# EAGLE design ServoMatrix_1_2 (EAGLE 4.16)
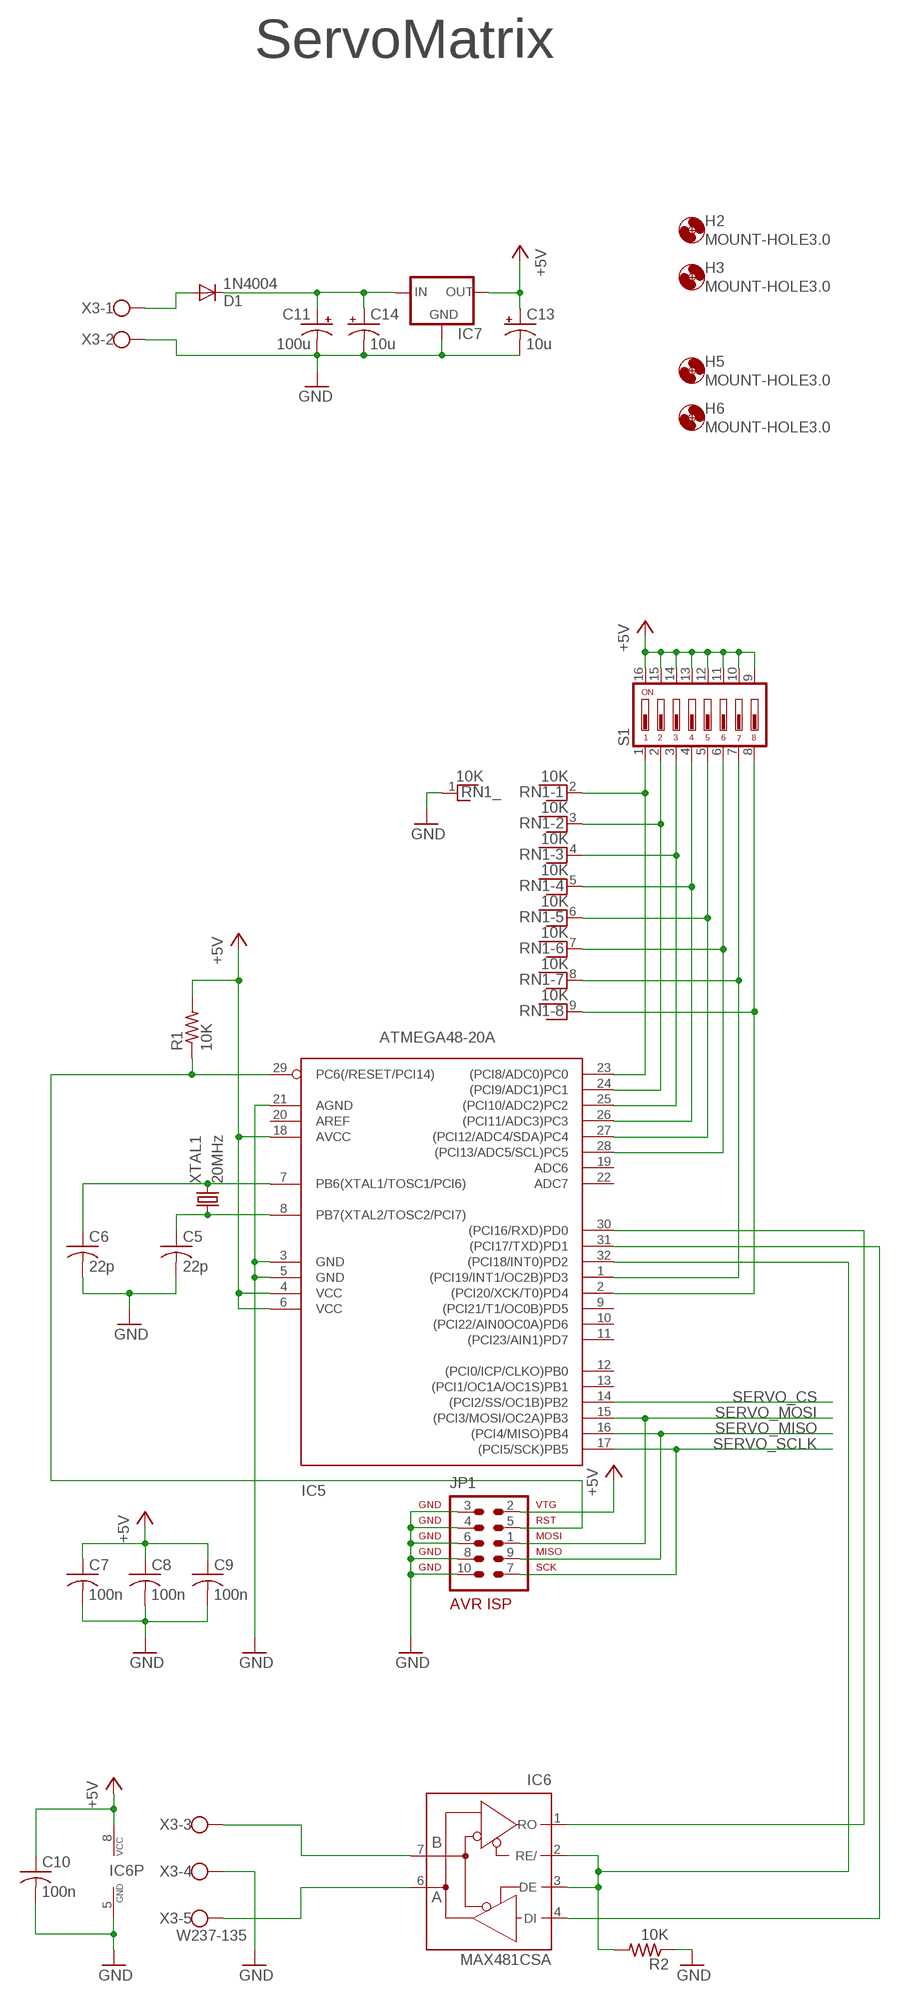
[diagram p0: schematic, sheet 1, part 1 of 2]
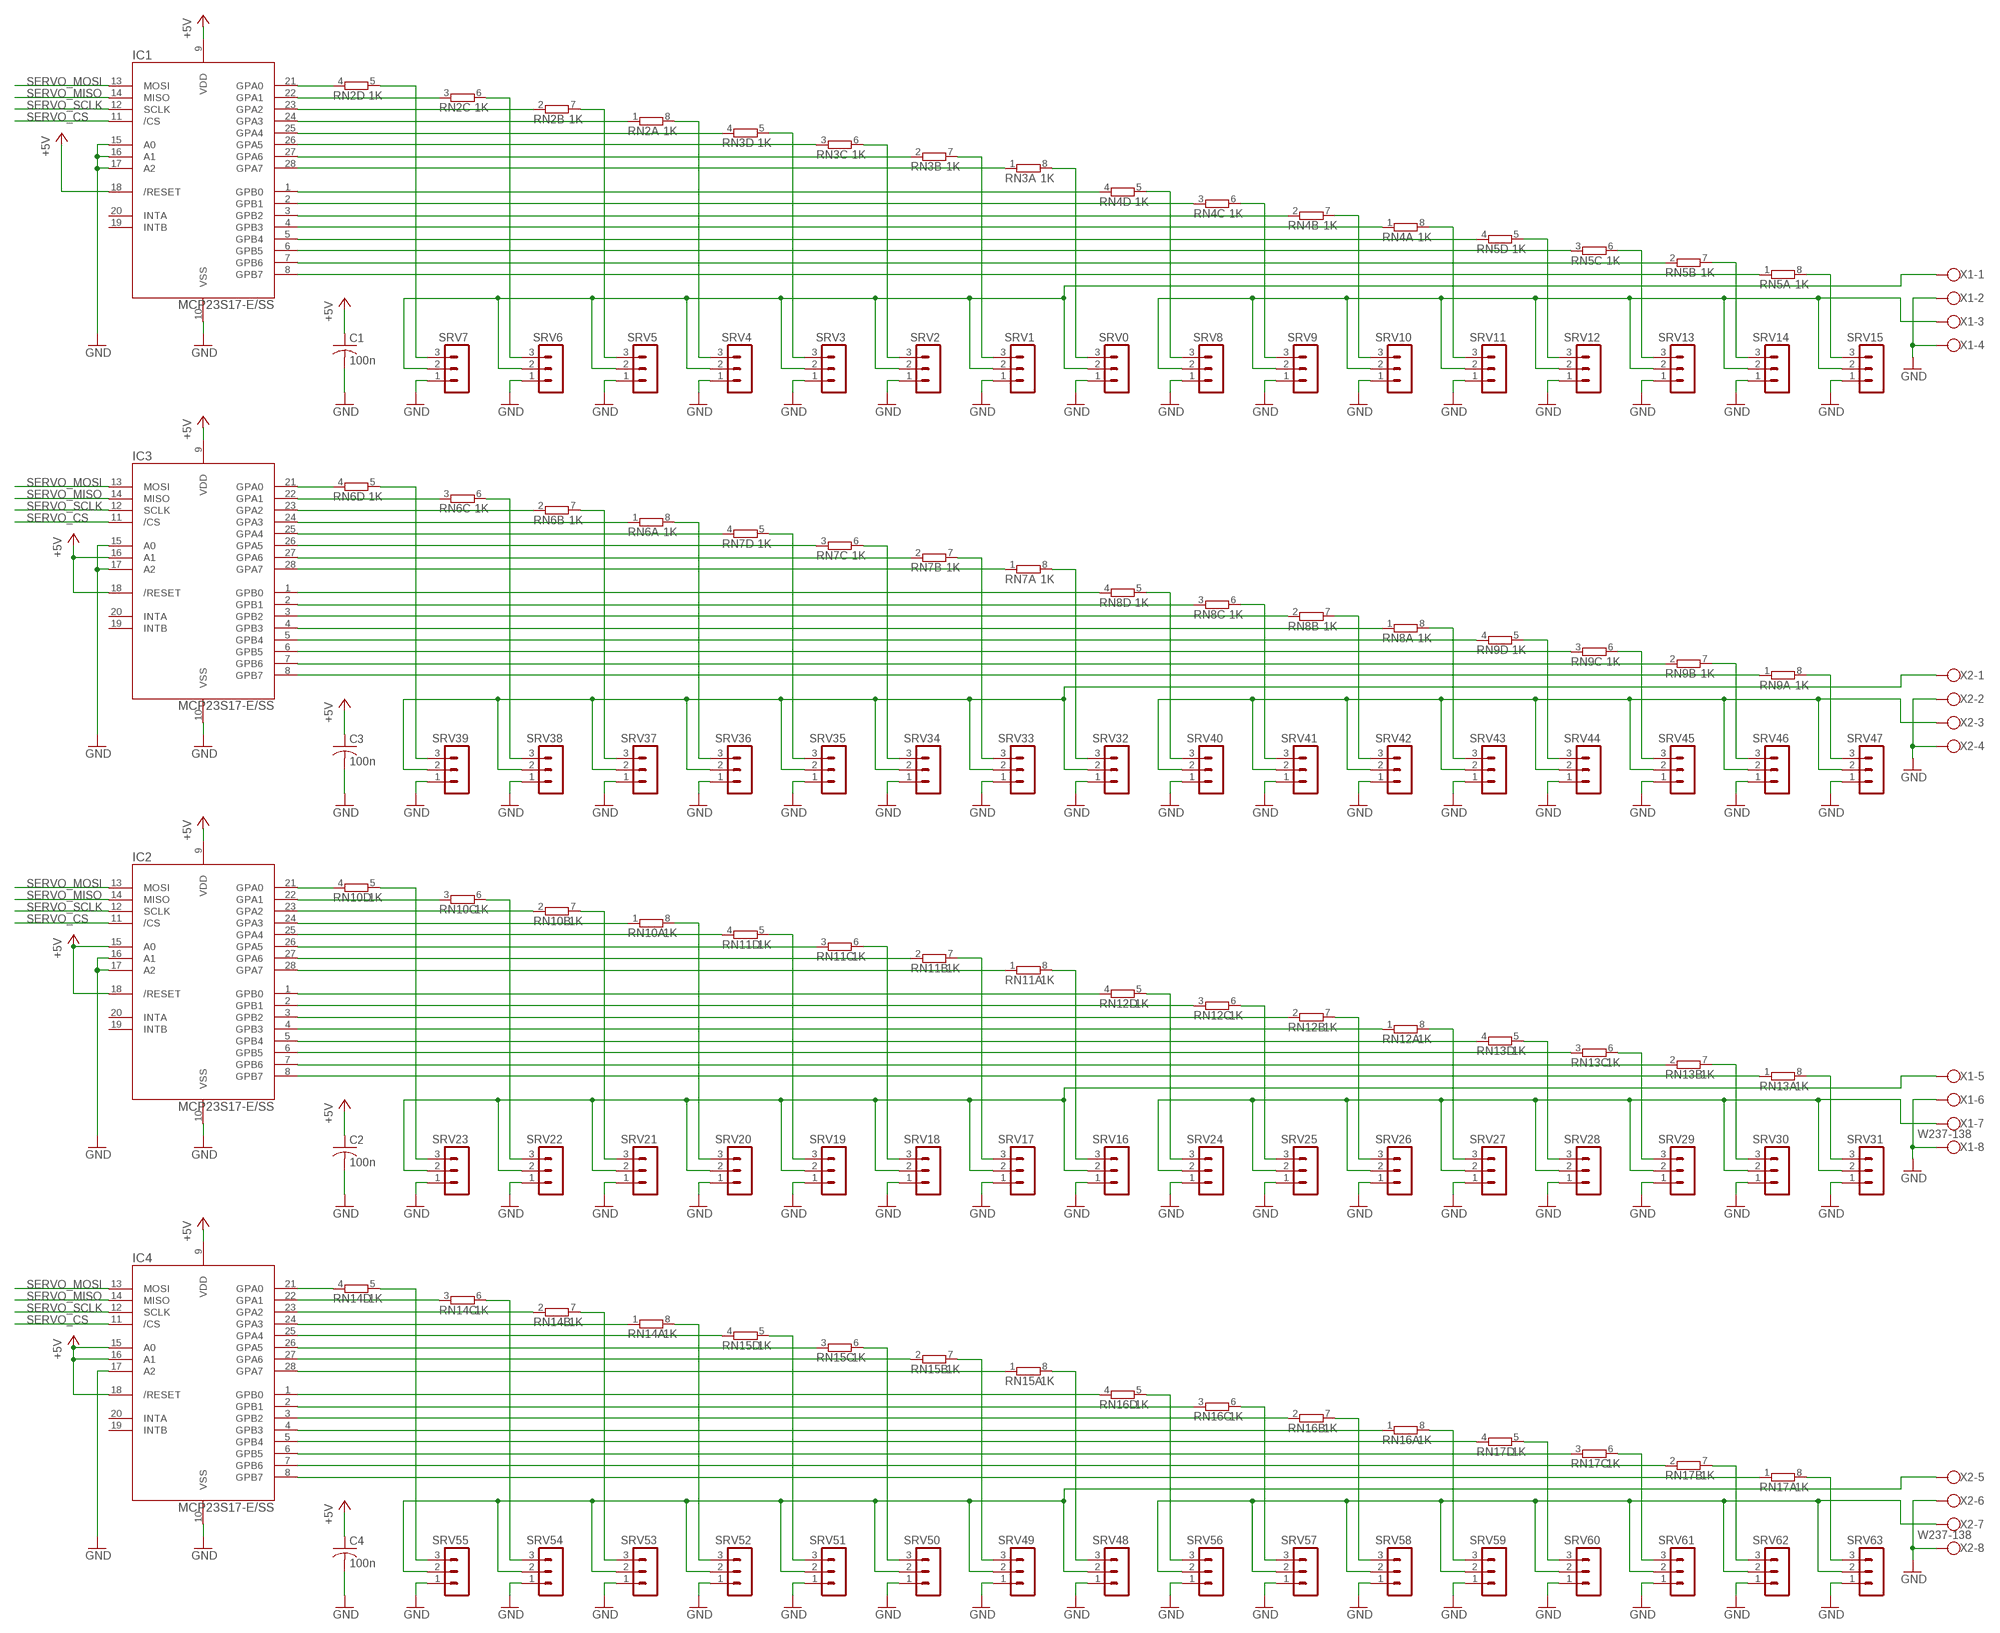
[diagram p1: schematic, sheet 1, part 2 of 2]

## Parts
C1  100n  C-USC0805  [C0805]
C2  100n  C-USC0805  [C0805]
C3  100n  C-USC0805  [C0805]
C4  100n  C-USC0805  [C0805]
C5  22p  C-USC0805  [C0805]
C6  22p  C-USC0805  [C0805]
C7  100n  C-USC0805  [C0805]
C8  100n  C-USC0805  [C0805]
C9  100n  C-USC0805  [C0805]
C10  100n  C-USC0805  [C0805]
C11  100u  CPOL-USD  [PANASONIC_D]
C13  10u  CPOL-USB  [PANASONIC_B]
C14  10u  CPOL-USB  [PANASONIC_B]
D1  1N4004  [DO41-10]
H2  MOUNT-HOLE3.0  [3,0]
H3  MOUNT-HOLE3.0  [3,0]
H5  MOUNT-HOLE3.0  [3,0]
H6  MOUNT-HOLE3.0  [3,0]
IC1  MCP23S17-E/SS  MCP23S17-E/SS-MFG  [SSOP-28-MFG]
IC2  MCP23S17-E/SS  MCP23S17-E/SS-MFG  [SSOP-28-MFG]
IC3  MCP23S17-E/SS  MCP23S17-E/SS-MFG  [SSOP-28-MFG]
IC4  MCP23S17-E/SS  MCP23S17-E/SS-MFG  [SSOP-28-MFG]
IC5  ATMEGA48-20A  [TQFP32-08]
IC6  MAX481CSA  [SO08]
IC7  LM1117  [SOT223]
JP1  AVR-ISP-10ML  [ML10]
R1  10K  R-US_M0805  [M0805]
R2  10K  R-US_M0805  [M0805]
RN1  10K  RNX9  [RN-10]
RN2  1K  4R-N0603-ARC  [0603-ARC]
RN3  1K  4R-N0603-ARC  [0603-ARC]
RN4  1K  4R-N0603-ARC  [0603-ARC]
RN5  1K  4R-N0603-ARC  [0603-ARC]
RN6  1K  4R-N0603-ARC  [0603-ARC]
RN7  1K  4R-N0603-ARC  [0603-ARC]
RN8  1K  4R-N0603-ARC  [0603-ARC]
RN9  1K  4R-N0603-ARC  [0603-ARC]
RN10  1K  4R-N0603-ARC  [0603-ARC]
RN11  1K  4R-N0603-ARC  [0603-ARC]
RN12  1K  4R-N0603-ARC  [0603-ARC]
RN13  1K  4R-N0603-ARC  [0603-ARC]
RN14  1K  4R-N0603-ARC  [0603-ARC]
RN15  1K  4R-N0603-ARC  [0603-ARC]
RN16  1K  4R-N0603-ARC  [0603-ARC]
RN17  1K  4R-N0603-ARC  [0603-ARC]
S1  DIP08YL  [DIP08YL]
SRV0  MA03-1  [MA03-1]
SRV1  MA03-1  [MA03-1]
SRV2  MA03-1  [MA03-1]
SRV3  MA03-1  [MA03-1]
SRV4  MA03-1  [MA03-1]
SRV5  MA03-1  [MA03-1]
SRV6  MA03-1  [MA03-1]
SRV7  MA03-1  [MA03-1]
SRV8  MA03-1  [MA03-1]
SRV9  MA03-1  [MA03-1]
SRV10  MA03-1  [MA03-1]
SRV11  MA03-1  [MA03-1]
SRV12  MA03-1  [MA03-1]
SRV13  MA03-1  [MA03-1]
SRV14  MA03-1  [MA03-1]
SRV15  MA03-1  [MA03-1]
SRV16  MA03-1  [MA03-1]
SRV17  MA03-1  [MA03-1]
SRV18  MA03-1  [MA03-1]
SRV19  MA03-1  [MA03-1]
SRV20  MA03-1  [MA03-1]
SRV21  MA03-1  [MA03-1]
SRV22  MA03-1  [MA03-1]
SRV23  MA03-1  [MA03-1]
SRV24  MA03-1  [MA03-1]
SRV25  MA03-1  [MA03-1]
SRV26  MA03-1  [MA03-1]
SRV27  MA03-1  [MA03-1]
SRV28  MA03-1  [MA03-1]
SRV29  MA03-1  [MA03-1]
SRV30  MA03-1  [MA03-1]
SRV31  MA03-1  [MA03-1]
SRV32  MA03-1  [MA03-1]
SRV33  MA03-1  [MA03-1]
SRV34  MA03-1  [MA03-1]
SRV35  MA03-1  [MA03-1]
SRV36  MA03-1  [MA03-1]
SRV37  MA03-1  [MA03-1]
SRV38  MA03-1  [MA03-1]
SRV39  MA03-1  [MA03-1]
SRV40  MA03-1  [MA03-1]
SRV41  MA03-1  [MA03-1]
SRV42  MA03-1  [MA03-1]
SRV43  MA03-1  [MA03-1]
SRV44  MA03-1  [MA03-1]
SRV45  MA03-1  [MA03-1]
SRV46  MA03-1  [MA03-1]
SRV47  MA03-1  [MA03-1]
SRV48  MA03-1  [MA03-1]
SRV49  MA03-1  [MA03-1]
SRV50  MA03-1  [MA03-1]
SRV51  MA03-1  [MA03-1]
SRV52  MA03-1  [MA03-1]
SRV53  MA03-1  [MA03-1]
SRV54  MA03-1  [MA03-1]
SRV55  MA03-1  [MA03-1]
SRV56  MA03-1  [MA03-1]
SRV57  MA03-1  [MA03-1]
SRV58  MA03-1  [MA03-1]
SRV59  MA03-1  [MA03-1]
SRV60  MA03-1  [MA03-1]
SRV61  MA03-1  [MA03-1]
SRV62  MA03-1  [MA03-1]
SRV63  MA03-1  [MA03-1]
X1  W237-138  [W237-138]
X2  W237-138  [W237-138]
X3  W237-135  [W237-135]
XTAL1  20MHz  CRYSTALHC49S  [HC49/S]

## Nets
+5V: C1.1 C2.1 C3.1 C4.1 C7.1 C8.1 C9.1 C10.1 C13.+ IC1.9(VDD) IC1.18(/RESET) IC2.9(VDD) IC2.15(A0) IC2.18(/RESET) IC3.9(VDD) IC3.16(A1) IC3.18(/RESET) IC4.9(VDD) IC4.15(A0) IC4.16(A1) IC4.18(/RESET) IC5.4(VCC) IC5.6(VCC) IC5.18(AVCC) IC6.8(VCC) IC7.2(OUT) JP1.2 R1.2 S1.9 S1.10 S1.11 S1.12 S1.13 S1.14 S1.15 S1.16
GND: C1.2 C2.2 C3.2 C4.2 C5.2 C6.2 C7.2 C8.2 C9.2 C10.2 C11.- C13.- C14.- IC1.10(VSS) IC1.15(A0) IC1.16(A1) IC1.17(A2) IC2.10(VSS) IC2.16(A1) IC2.17(A2) IC3.10(VSS) IC3.15(A0) IC3.17(A2) IC4.10(VSS) IC4.17(A2) IC5.3(GND) IC5.5(GND) IC5.21(AGND) IC6.5(GND) IC7.1(GND) JP1.3 JP1.4 JP1.6 JP1.8 JP1.10 R2.1 RN1.1 SRV0.1 SRV1.1 SRV2.1 SRV3.1 SRV4.1 SRV5.1 SRV6.1 SRV7.1 SRV8.1 SRV9.1 SRV10.1 SRV11.1 SRV12.1 SRV13.1 SRV14.1 SRV15.1 SRV16.1 SRV17.1 SRV18.1 SRV19.1 SRV20.1 SRV21.1 SRV22.1 SRV23.1 SRV24.1 SRV25.1 SRV26.1 SRV27.1 SRV28.1 SRV29.1 SRV30.1 SRV31.1 SRV32.1 SRV33.1 SRV34.1 SRV35.1 SRV36.1 SRV37.1 SRV38.1 SRV39.1 SRV40.1 SRV41.1 SRV42.1 SRV43.1 SRV44.1 SRV45.1 SRV46.1 SRV47.1 SRV48.1 SRV49.1 SRV50.1 SRV51.1 SRV52.1 SRV53.1 SRV54.1 SRV55.1 SRV56.1 SRV57.1 SRV58.1 SRV59.1 SRV60.1 SRV61.1 SRV62.1 SRV63.1 X1.2 X1.4 X1.6 X1.8 X2.2 X2.4 X2.6 X2.8 X3.2 X3.4
N$1: RN2.5 SRV7.3
N$2: IC1.21(GPA0) RN2.4
N$3: RN2.6 SRV6.3
N$4: IC1.22(GPA1) RN2.3
N$5: RN2.7 SRV5.3
N$6: IC1.23(GPA2) RN2.2
N$7: RN2.8 SRV4.3
N$8: IC1.24(GPA3) RN2.1
N$9: RN3.5 SRV3.3
N$10: IC1.25(GPA4) RN3.4
N$11: RN3.6 SRV2.3
N$12: IC1.26(GPA5) RN3.3
N$13: RN3.7 SRV1.3
N$14: IC1.27(GPA6) RN3.2
N$15: RN3.8 SRV0.3
N$16: IC1.28(GPA7) RN3.1
N$17: RN4.5 SRV8.3
N$18: IC1.8(GPB7) RN5.1
N$19: RN4.6 SRV9.3
N$20: IC1.7(GPB6) RN5.2
N$21: RN4.7 SRV10.3
N$22: IC1.6(GPB5) RN5.3
N$23: RN4.8 SRV11.3
N$24: IC1.5(GPB4) RN5.4
N$25: RN5.5 SRV12.3
N$26: IC1.4(GPB3) RN4.1
N$27: RN5.6 SRV13.3
N$28: IC1.3(GPB2) RN4.2
N$29: RN5.7 SRV14.3
N$30: IC1.2(GPB1) RN4.3
N$31: RN5.8 SRV15.3
N$32: IC1.1(GPB0) RN4.4
N$33: IC3.21(GPA0) RN6.4
N$34: IC3.22(GPA1) RN6.3
N$35: SRV8.2 SRV9.2 SRV10.2 SRV11.2 SRV12.2 SRV13.2 SRV14.2 SRV15.2 X1.3
N$36: IC3.23(GPA2) RN6.2
N$37: IC3.24(GPA3) RN6.1
N$38: IC3.25(GPA4) RN7.4
N$39: IC3.26(GPA5) RN7.3
N$40: IC3.27(GPA6) RN7.2
N$41: IC3.28(GPA7) RN7.1
N$42: SRV16.2 SRV17.2 SRV18.2 SRV19.2 SRV20.2 SRV21.2 SRV22.2 SRV23.2 X1.5
N$43: IC3.1(GPB0) RN8.4
N$44: IC3.2(GPB1) RN8.3
N$45: IC3.3(GPB2) RN8.2
N$46: IC3.4(GPB3) RN8.1
N$47: IC3.5(GPB4) RN9.4
N$48: IC3.6(GPB5) RN9.3
N$49: IC3.7(GPB6) RN9.2
N$50: IC3.8(GPB7) RN9.1
N$51: IC2.21(GPA0) RN10.4
N$52: IC2.22(GPA1) RN10.3
N$53: RN10.5 SRV23.3
N$54: IC2.23(GPA2) RN10.2
N$55: RN10.6 SRV22.3
N$56: IC2.24(GPA3) RN10.1
N$57: RN10.7 SRV21.3
N$58: IC2.25(GPA4) RN11.4
N$59: RN10.8 SRV20.3
N$60: IC2.26(GPA5) RN11.3
N$61: RN11.5 SRV19.3
N$62: IC2.27(GPA6) RN11.2
N$63: RN11.6 SRV18.3
N$64: IC2.28(GPA7) RN11.1
N$65: RN11.7 SRV17.3
N$66: IC2.8(GPB7) RN13.1
N$67: RN11.8 SRV16.3
N$68: IC2.7(GPB6) RN13.2
N$69: RN12.5 SRV24.3
N$70: IC2.6(GPB5) RN13.3
N$71: RN12.6 SRV25.3
N$72: IC2.5(GPB4) RN13.4
N$73: RN12.7 SRV26.3
N$74: IC2.4(GPB3) RN12.1
N$75: RN12.8 SRV27.3
N$76: IC2.3(GPB2) RN12.2
N$77: RN13.5 SRV28.3
N$78: IC2.2(GPB1) RN12.3
N$79: RN13.6 SRV29.3
N$80: IC2.1(GPB0) RN12.4
N$81: RN13.7 SRV30.3
N$82: IC4.8(GPB7) RN17.1
N$83: RN13.8 SRV31.3
N$84: IC4.7(GPB6) RN17.2
N$85: SRV24.2 SRV25.2 SRV26.2 SRV27.2 SRV28.2 SRV29.2 SRV30.2 SRV31.2 X1.7
N$86: IC4.6(GPB5) RN17.3
N$87: C6.1 IC5.7(PB6(XTAL1/TOSC1/PCI6)) XTAL1.2
N$88: C5.1 IC5.8(PB7(XTAL2/TOSC2/PCI7)) XTAL1.1
N$89: IC4.5(GPB4) RN17.4
N$90: IC4.4(GPB3) RN16.1
N$91: IC4.3(GPB2) RN16.2
N$92: IC4.2(GPB1) RN16.3
N$93: IC4.1(GPB0) RN16.4
N$94: IC4.28(GPA7) RN15.1
N$95: IC4.27(GPA6) RN15.2
N$96: IC4.26(GPA5) RN15.3
N$97: IC4.25(GPA4) RN15.4
N$98: IC4.24(GPA3) RN14.1
N$99: IC4.23(GPA2) RN14.2
N$100: IC4.22(GPA1) RN14.3
N$101: IC4.21(GPA0) RN14.4
N$102: D1.A X3.1
N$104: C11.+ C14.+ D1.C IC7.3(IN)
N$105: RN6.5 SRV39.3
N$107: RN6.6 SRV38.3
N$108: SRV32.2 SRV33.2 SRV34.2 SRV35.2 SRV36.2 SRV37.2 SRV38.2 SRV39.2 X2.1
N$109: RN6.7 SRV37.3
N$111: RN6.8 SRV36.3
N$113: RN7.5 SRV35.3
N$115: RN7.6 SRV34.3
N$117: RN7.7 SRV33.3
N$119: RN7.8 SRV32.3
N$121: RN8.5 SRV40.3
N$123: RN8.6 SRV41.3
N$125: RN8.7 SRV42.3
N$127: RN8.8 SRV43.3
N$129: RN9.5 SRV44.3
N$131: RN9.6 SRV45.3
N$133: RN9.7 SRV46.3
N$135: RN9.8 SRV47.3
N$137: SRV40.2 SRV41.2 SRV42.2 SRV43.2 SRV44.2 SRV45.2 SRV46.2 SRV47.2 X2.3
N$138: IC5.23((PCI8/ADC0)PC0) RN1.2 S1.1
N$139: IC5.24((PCI9/ADC1)PC1) RN1.3 S1.2
N$140: IC5.25((PCI10/ADC2)PC2) RN1.4 S1.3
N$157: RN14.5 SRV55.3
N$159: RN14.6 SRV54.3
N$161: RN14.7 SRV53.3
N$163: RN14.8 SRV52.3
N$165: RN15.5 SRV51.3
N$167: RN15.6 SRV50.3
N$169: RN15.7 SRV49.3
N$171: RN15.8 SRV48.3
N$172: SRV48.2 SRV49.2 SRV50.2 SRV51.2 SRV52.2 SRV53.2 SRV54.2 SRV55.2 X2.5
N$173: RN16.5 SRV56.3
N$175: RN16.6 SRV57.3
N$176: SRV56.2 SRV57.2 SRV58.2 SRV59.2 SRV60.2 SRV61.2 SRV62.2 SRV63.2 X2.7
N$177: RN16.7 SRV58.3
N$179: RN16.8 SRV59.3
N$181: RN17.5 SRV60.3
N$183: RN17.6 SRV61.3
N$185: RN17.7 SRV62.3
N$187: RN17.8 SRV63.3
N$190: IC5.26((PCI11/ADC3)PC3) RN1.5 S1.4
N$191: IC5.27((PCI12/ADC4/SDA)PC4) RN1.6 S1.5
N$192: IC5.28((PCI13/ADC5/SCL)PC5) RN1.7 S1.6
N$209: IC5.1((PCI19/INT1/OC2B)PD3) RN1.8 S1.7
N$210: IC5.2((PCI20/XCK/T0)PD4) RN1.9 S1.8
N$226: IC5.30((PCI16/RXD)PD0) IC6.1(RO)
N$227: IC5.31((PCI17/TXD)PD1) IC6.4(DI)
N$228: IC5.32((PCI18/INT0)PD2) IC6.2(RE/) IC6.3(DE) R2.2
N$231: IC5.29(PC6(/RESET/PCI14)) JP1.5 R1.1
RS285_A: IC6.6(A) X3.5
RS485_B: IC6.7(B) X3.3
SERVO_CS: IC1.11(/CS) IC2.11(/CS) IC3.11(/CS) IC4.11(/CS) IC5.14((PCI2/SS/OC1B)PB2)
SERVO_MISO: IC1.14(MISO) IC2.14(MISO) IC3.14(MISO) IC4.14(MISO) IC5.16((PCI4/MISO)PB4) JP1.9
SERVO_MOSI: IC1.13(MOSI) IC2.13(MOSI) IC3.13(MOSI) IC4.13(MOSI) IC5.15((PCI3/MOSI/OC2A)PB3) JP1.1
SERVO_SCLK: IC1.12(SCLK) IC2.12(SCLK) IC3.12(SCLK) IC4.12(SCLK) IC5.17((PCI5/SCK)PB5) JP1.7
SRV0: SRV0.2 SRV1.2 SRV2.2 SRV3.2 SRV4.2 SRV5.2 SRV6.2 SRV7.2 X1.1
Unconnected: IC1.19(INTB) IC1.20(INTA) IC2.19(INTB) IC2.20(INTA) IC3.19(INTB) IC3.20(INTA) IC4.19(INTB) IC4.20(INTA) IC5.9((PCI21/T1/OC0B)PD5) IC5.10((PCI22/AIN0OC0A)PD6) IC5.11((PCI23/AIN1)PD7) IC5.12((PCI0/ICP/CLKO)PB0) IC5.13((PCI1/OC1A/OC1S)PB1) IC5.19(ADC6) IC5.20(AREF) IC5.22(ADC7) RN1.10

## Notes on the sheet
- ServoMatrix

## Library data of the parts
C1-C10 = rcl:C-US: CAPACITOR, American symbol
C11 C13 C14 = rcl:CPOL-US: POLARIZED CAPACITOR, American symbol
D1 = diode:1N4004: DIODE general purpose rectifier, 1 A
H2 H3 H5 H6 = holes:MOUNT-HOLE: MOUNTING HOLE with drill center marker
IC1-IC4 = rbg-microchip-ioexpander:MCP23S17
IC5 = avr:ATMEGA48: MICROCONTROLLER 4 Kbytes FLASH 512 Bytes SRAM 256 Bytes EEPROM USART 8-channel 10 bit ADC
IC6 = maxim:MAX481CSA: RS485 TRANSEIVER
IC7 = v-reg-3:LM1117
JP1 = atmel-1:AVR-ISP-10: AVR ISP-10 Serial Programming Header
R1 R2 = rcl:R-US_: RESISTOR, American symbol
RN1 = resistor-net:RNX9: RESISTOR NETWORK
RN2-RN17 = resistor-dil:4R-N: Array Chip Resistor Source: RS Component / Phycomp
S1 = switch-dil:DIP08YL: DIL/CODE SWITCH
SRV0 SRV1-SRV63 = con-lstb:MA03-1: PIN HEADER
X1 X2 = rbg-generic-screwterm-5mm:W237-138
X3 = rbg-generic-screwterm-5mm:W237-135
XTAL1 = crystal:CRYSTAL: CRYSTAL

## Board
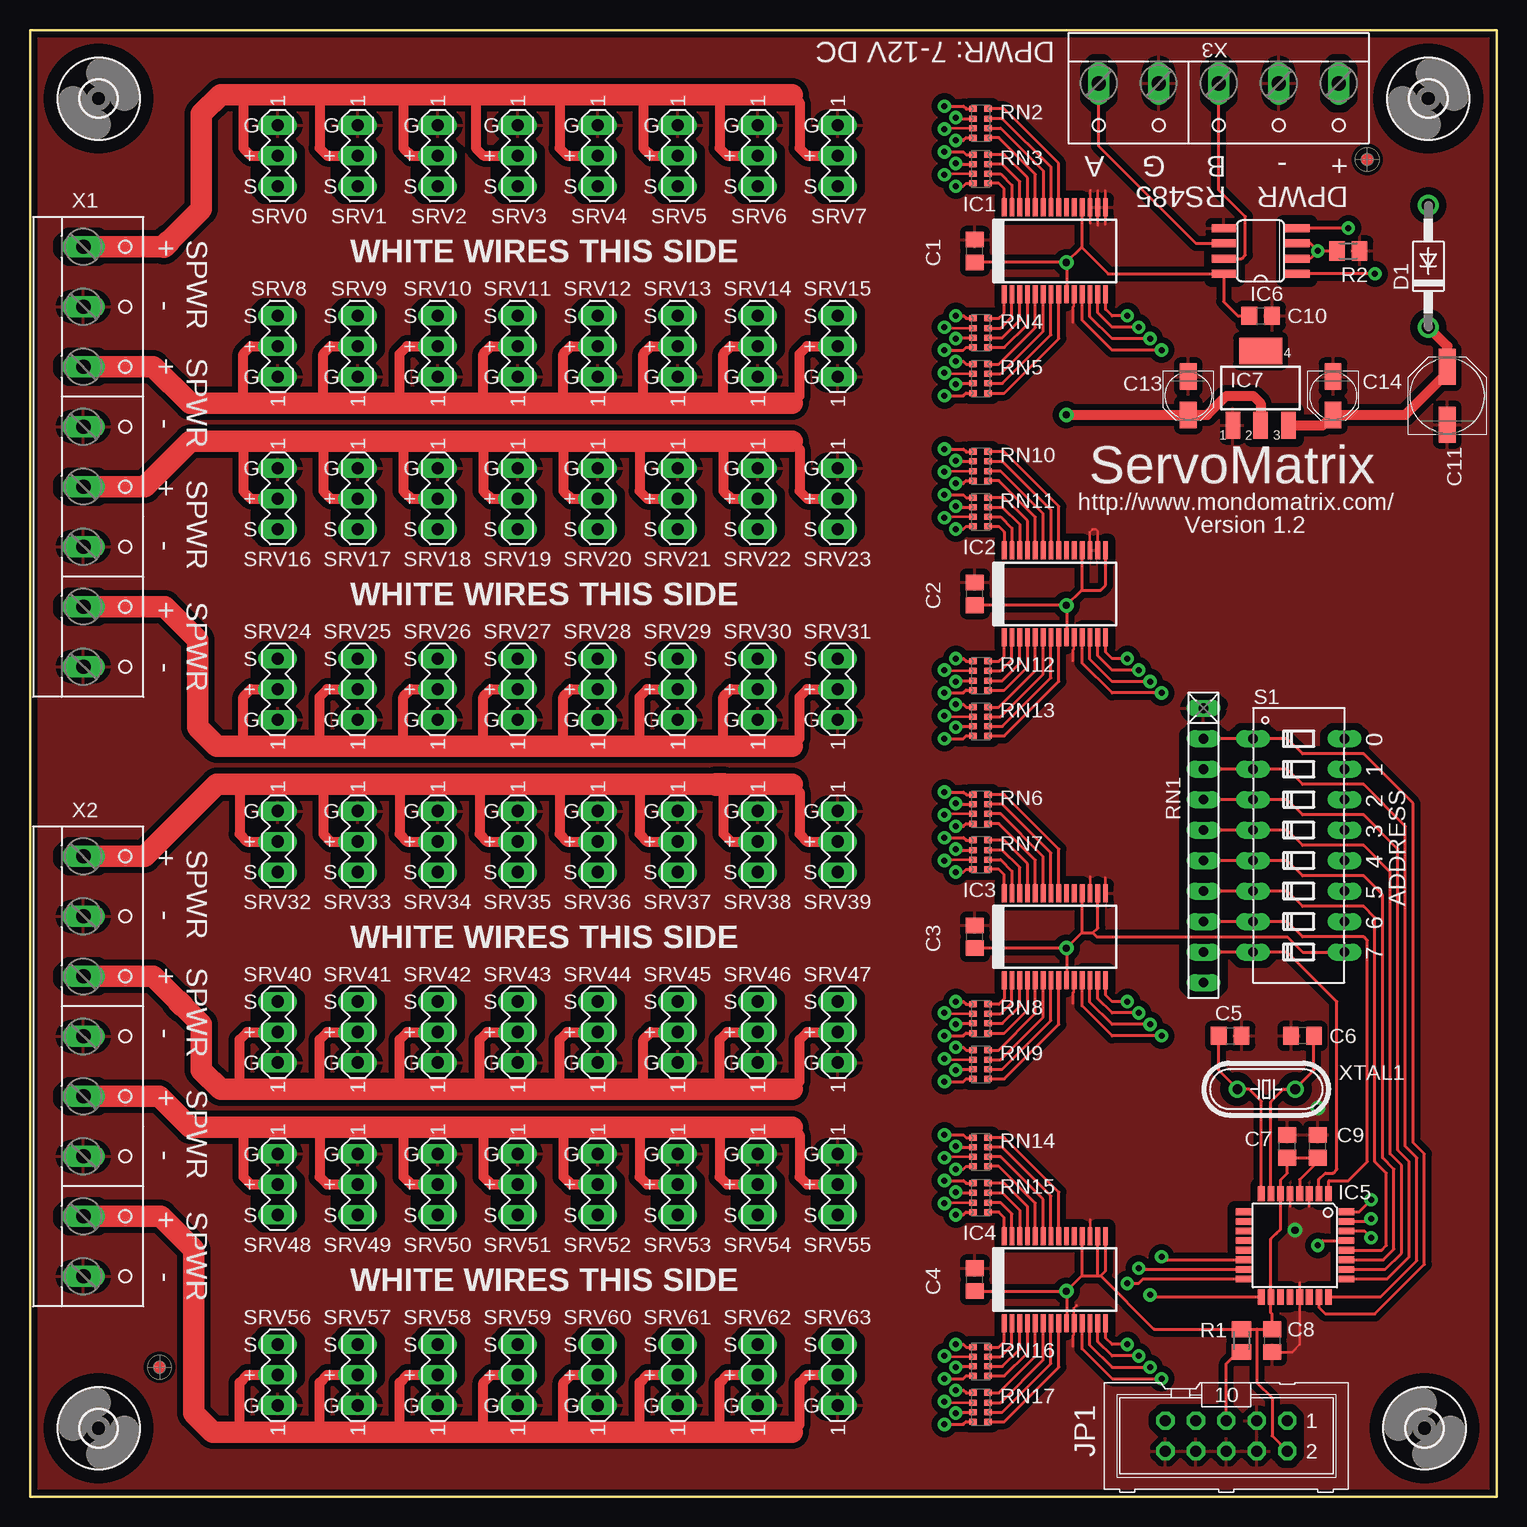
[diagram p2: board, top side]
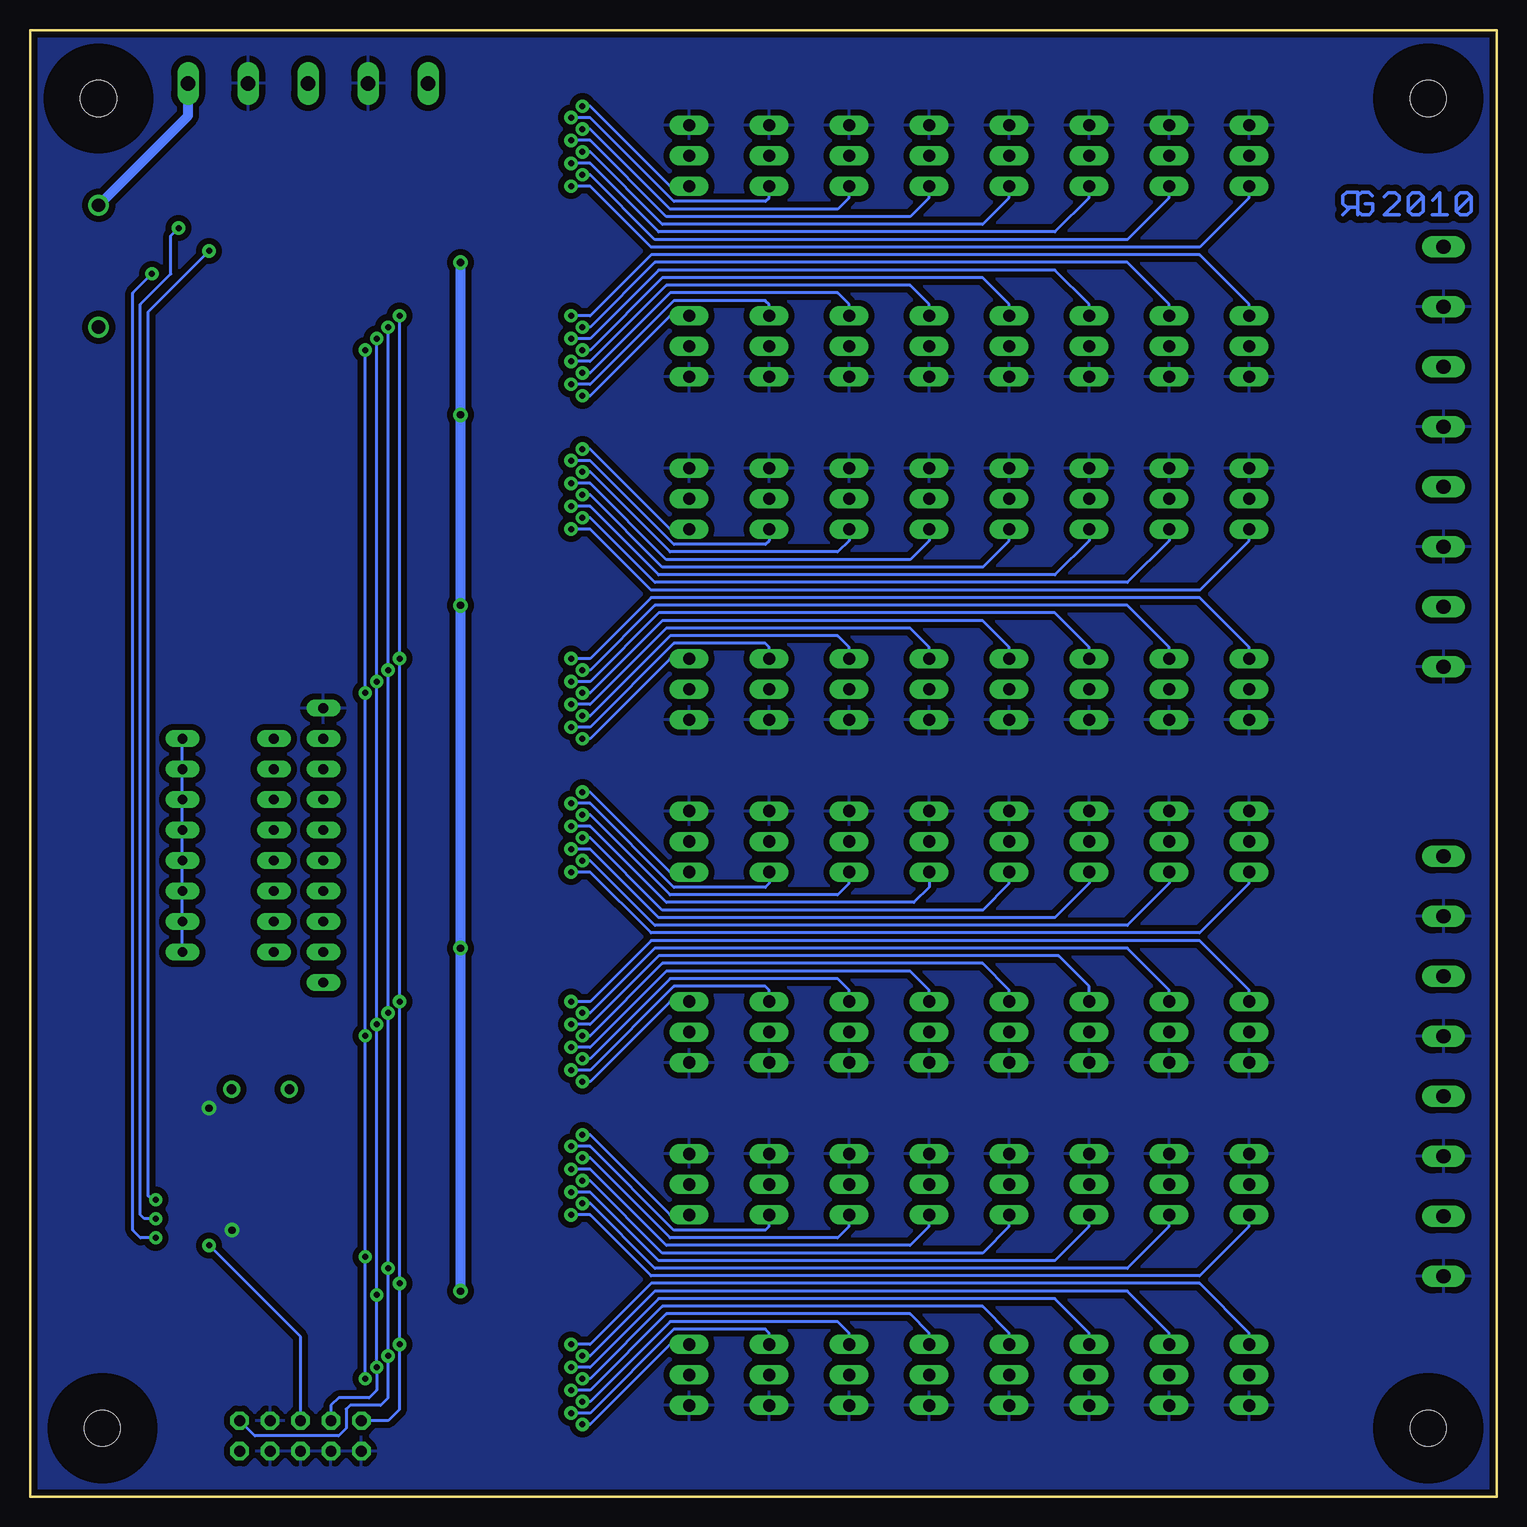
[diagram p3: board, bottom side, seen from below]

Size 122.24 x 122.24 mm. Coordinates in mm from the lower left corner, seen from the top.
Outline: 0,0 0,122.24 122.24,122.24 122.24,0 0,0
Copper layers (1*16): Top 0.035mm / dielectric 1.5mm / Bottom 0.035mm
Design rules "default": minimum track width 8mil, minimum drill 19mil, track to track 8mil, track to pad 8mil, pad to pad 8mil, via to via 8mil, smd to smd 8mil, copper to edge 10mil, drill to drill 8mil, minimum pad ring 12mil, minimum via ring 12mil, stop-mask expansion 4mil, vias tented up to drill 28mil, thermal gap 20mil
tRestrict: area 115.6,106.7 to 117.4,108.5; area 115.6,96.6 to 117.4,98.4; area 99.8,33.2 to 101.3,34.8; area 104.6,33.2 to 106.2,34.8; 801 lines

### Footprints (pad centres in the part's own frame; a part is rotated, then mirrored left to right if it is on the bottom)
C0805 = smd 1.3 x 1.5: 1 -0.95,0; 2 0.95,0
PANASONIC_D = smd 3 x 1.4: + 2.4,0; - -2.4,0
PANASONIC_B = smd 2.2 x 1.4: + 1.6,0; - -1.6,0
DO41-10 = drill 1.118 round: A 5.08,0; C -5.08,0
3,0 = hole 3: 0,0
SSOP-28-MFG = smd 0.4 x 1.5: 1 -4.225,-3.625; 2 -3.575,-3.625; 3 -2.925,-3.625; 4 -2.275,-3.625; 5 -1.625,-3.625; 6 -0.975,-3.625; 7 -0.325,-3.625; 8 0.325,-3.625; 9 0.975,-3.625; 10 1.625,-3.625; 11 2.275,-3.625; 12 2.925,-3.625; 13 3.575,-3.625; 14 4.225,-3.625; 15 4.225,3.625; 16 3.575,3.625; 17 2.925,3.625; 18 2.275,3.625; 19 1.625,3.625; 20 0.975,3.625; 21 0.325,3.625; 22 -0.325,3.625; 23 -0.975,3.625; 24 -1.625,3.625; 25 -2.275,3.625; 26 -2.925,3.625; 27 -3.575,3.625; 28 -4.225,3.625
TQFP32-08 = smd 1.27 x 0.559: 1 -4.293,2.8; 2 -4.293,2; 3 -4.293,1.2; 4 -4.293,0.4; 5 -4.293,-0.4; 6 -4.293,-1.2; 7 -4.293,-2; 8 -4.293,-2.8; 17 4.293,-2.8; 18 4.293,-2; 19 4.293,-1.2; 20 4.293,-0.4; 21 4.293,0.4; 22 4.293,1.2; 23 4.293,2; 24 4.293,2.8 | smd 0.559 x 1.27: 9 -2.8,-4.293; 10 -2,-4.293; 11 -1.2,-4.293; 12 -0.4,-4.293; 13 0.4,-4.293; 14 1.2,-4.293; 15 2,-4.293; 16 2.8,-4.293; 25 2.8,4.293; 26 2,4.293; 27 1.2,4.293; 28 0.4,4.293; 29 -0.4,4.293; 30 -1.2,4.293; 31 -2,4.293; 32 -2.8,4.293
SO08 = smd 0.66 x 2.032: 1 -1.905,-3.073; 2 -0.635,-3.073; 3 0.635,-3.073; 4 1.905,-3.073; 5 1.905,3.073; 6 0.635,3.073; 7 -0.635,3.073; 8 -1.905,3.073
SOT223 = smd 1.219 x 2.235: 1 -2.311,-3.099; 2 0,-3.099; 3 2.311,-3.099 | smd 3.6 x 2.2: 4 0,3.099
ML10 = drill 0.914 octagon: 1 -5.08,-1.27; 2 -5.08,1.27; 3 -2.54,-1.27; 4 -2.54,1.27; 5 0,-1.27; 6 0,1.27; 7 2.54,-1.27; 8 2.54,1.27; 9 5.08,-1.27; 10 5.08,1.27
M0805 = smd 1.3 x 1.6: 1 -0.95,0; 2 0.95,0
RN-10 = drill 0.813 long: 1 -11.43,0; 2 -8.89,0; 3 -6.35,0; 4 -3.81,0; 5 -1.27,0; 6 1.27,0; 7 3.81,0; 8 6.35,0; 9 8.89,0; 10 11.43,0
0603-ARC = smd 0.5 x 0.65: 1 -1.2,-0.625; 2 -0.4,-0.625; 3 0.4,-0.625; 4 1.2,-0.625; 5 1.2,0.625; 6 0.4,0.625; 7 -0.4,0.625; 8 -1.2,0.625
DIP08YL = drill 0.813 long: 1 -8.89,-3.81; 2 -6.35,-3.81; 3 -3.81,-3.81; 4 -1.27,-3.81; 5 1.27,-3.81; 6 3.81,-3.81; 7 6.35,-3.81; 8 8.89,-3.81; 9 8.89,3.81; 10 6.35,3.81; 11 3.81,3.81; 12 1.27,3.81; 13 -1.27,3.81; 14 -3.81,3.81; 15 -6.35,3.81; 16 -8.89,3.81
MA03-1 = drill 1.016 long: 1 -2.54,0; 2 0,0; 3 2.54,0
W237-138 = drill 1.194 long: 1 -17.5,-1.27; 2 -12.5,-1.27; 3 -7.5,-1.27; 4 -2.5,-1.27; 5 2.5,-1.27; 6 7.5,-1.27; 7 12.5,-1.27; 8 17.5,-1.27
W237-135 = drill 1.194 long: 1 -10,-1.27; 2 -5,-1.27; 3 0,-1.27; 4 5,-1.27; 5 10,-1.27
HC49/S = drill 0.813 round: 1 -2.413,0; 2 2.413,0

### Placement (x,y rotation side)
C1  78.74,103.82 90 top
C2  78.74,75.25 90 top
C3  78.74,46.67 90 top
C4  78.74,18.1 90 top
C5  100.01,38.42 0 top
C6  106.05,38.42 180 top
C7  104.78,29.21 90 top
C8  103.5,13.02 270 top
C9  107.31,29.21 90 top
C10  102.55,98.42 0 top
C11  118.11,91.76 90 top
C13  96.52,91.76 270 top
C14  108.58,91.76 270 top
D1  116.52,102.55 90 top
H2  5.71,116.52 0 top
H3  116.52,116.52 0 top
H5  116.2,5.71 90 top
H6  5.71,5.71 90 top
IC1  85.41,103.82 0 top
IC2  85.41,75.25 0 top
IC3  85.41,46.67 0 top
IC4  85.41,18.1 0 top
IC5  105.41,20.95 270 top
IC6  102.55,103.82 90 top
IC7  102.55,92.39 0 top
JP1  99.69,5.08 180 top
R1  100.97,13.02 90 top
R2  109.86,103.82 180 top
RN1  97.79,54.29 270 top
RN2  79.22,114.46 90 top
RN3  79.22,110.65 90 top
RN4  79.22,97 90 top
RN5  79.22,93.19 90 top
RN6  79.22,57.31 90 top
RN7  79.22,53.5 90 top
RN8  79.22,39.85 90 top
RN9  79.22,36.04 90 top
RN10  79.22,85.88 90 top
RN11  79.22,82.07 90 top
RN12  79.22,68.42 90 top
RN13  79.22,64.61 90 top
RN14  79.22,28.73 90 top
RN15  79.22,24.92 90 top
RN16  79.22,11.27 90 top
RN17  79.22,7.46 90 top
S1  105.73,54.29 270 top
SRV0  20.64,111.76 270 top
SRV1  27.3,111.76 270 top
SRV2  33.97,111.76 270 top
SRV3  40.64,111.76 270 top
SRV4  47.31,111.76 270 top
SRV5  53.98,111.76 270 top
SRV6  60.64,111.76 270 top
SRV7  67.31,111.76 270 top
SRV8  20.64,95.89 90 top
SRV9  27.3,95.89 90 top
SRV10  33.97,95.89 90 top
SRV11  40.64,95.89 90 top
SRV12  47.31,95.89 90 top
SRV13  53.98,95.89 90 top
SRV14  60.64,95.89 90 top
SRV15  67.31,95.89 90 top
SRV16  20.64,83.19 270 top
SRV17  27.3,83.19 270 top
SRV18  33.97,83.19 270 top
SRV19  40.64,83.19 270 top
SRV20  47.31,83.19 270 top
SRV21  53.98,83.19 270 top
SRV22  60.64,83.19 270 top
SRV23  67.31,83.19 270 top
SRV24  20.64,67.31 90 top
SRV25  27.3,67.31 90 top
SRV26  33.97,67.31 90 top
SRV27  40.64,67.31 90 top
SRV28  47.31,67.31 90 top
SRV29  53.98,67.31 90 top
SRV30  60.64,67.31 90 top
SRV31  67.31,67.31 90 top
SRV32  20.64,54.61 270 top
SRV33  27.3,54.61 270 top
SRV34  33.97,54.61 270 top
SRV35  40.64,54.61 270 top
SRV36  47.31,54.61 270 top
SRV37  53.98,54.61 270 top
SRV38  60.64,54.61 270 top
SRV39  67.31,54.61 270 top
SRV40  20.64,38.73 90 top
SRV41  27.3,38.73 90 top
SRV42  33.97,38.73 90 top
SRV43  40.64,38.73 90 top
SRV44  47.31,38.73 90 top
SRV45  53.98,38.73 90 top
SRV46  60.64,38.73 90 top
SRV47  67.31,38.73 90 top
SRV48  20.64,26.04 270 top
SRV49  27.3,26.04 270 top
SRV50  33.97,26.04 270 top
SRV51  40.64,26.04 270 top
SRV52  47.31,26.04 270 top
SRV53  53.98,26.04 270 top
SRV54  60.64,26.04 270 top
SRV55  67.31,26.04 270 top
SRV56  20.64,10.16 90 top
SRV57  27.3,10.16 90 top
SRV58  33.97,10.16 90 top
SRV59  40.64,10.16 90 top
SRV60  47.31,10.16 90 top
SRV61  53.98,10.16 90 top
SRV62  60.64,10.16 90 top
SRV63  67.31,10.16 90 top
U$1  [RGLOGO_SMALL_2010]  11.43,106.68 0 bottom
U$2  [FIDUCIAL_G10]  111.44,111.44 180 top
U$4  [FIDUCIAL_G10]  10.79,10.79 0 top
X1  5.71,86.68 270 top
X2  5.71,35.88 270 top
X3  99.06,116.52 180 top
XTAL1  103.03,33.97 0 top

### Tracks (layer width: path | path; a pad name or v marks a point on that pad's centre or on a via)
+5V  (via drill 0.6)
  Top 0.254: C9.1 107.31,27.94 105.81,26.43 IC5.4 | C8.1 103.5,15.24 103.41,15.34 IC5.18 103.41,21.5 103.82,21.91 | C8.1 | 102.23,13.97 R1.2 93.67,13.97 89.22,18.41 | 102.23,13.97 C8.1 | 86.38,17.12 86.38,17.17 | IC4.15 89.63,18.83 89.22,18.41 | 87.63,18.41 88.9,18.41 | 88.9,18.41 89.22,18.41 | IC4.16 88.98,18.5 88.9,18.41 | IC4.18 87.68,18.47 87.63,18.41 | IC3.16 88.98,47.39 88.58,46.99 | 87.63,46.99 88.58,46.99 | IC3.18 87.68,47.04 87.63,46.99 | IC2.15 89.63,75.98 89.22,75.56 87.63,75.56 | IC2.18 87.68,75.62 87.63,75.56 | IC1.18 87.68,104.19 87.63,104.14 | JP1.2 103.5,5.08 103.5,8.26 102.23,9.53 102.23,13.97 | 102.23,13.97 | C10.1 100.65,98.42 99.48,99.59 IC6.8 89.85,101.92 87.63,104.14 | S1.9 106.05,45.4 104.78,46.67 88.9,46.67 88.58,46.99 | 86.38,17.12 IC4.9 | v86.36,17.14 86.38,17.12 | C3.1 v86.36,45.72 | IC3.9 86.38,45.7 v86.36,45.72 | v86.36,45.72 87.63,46.99 | C4.1 v86.36,17.14 | v86.36,17.14 87.63,18.41 | IC2.9 86.38,74.27 v86.36,74.3 | v86.36,74.3 87.63,75.56 | C2.1 v86.36,74.3 | IC1.9 86.38,102.85 v86.36,102.87 | v86.36,102.87 87.63,104.14 | C1.1 v86.36,102.87 | 103.82,21.91 103.91,21.99 | 103.82,21.91 104.21,22.3 IC5.6 104.21,26.42 104.78,26.99 C7.1 | C7.1 | C9.1 | C7.1 C9.1
  Top 0.813: IC7.2 102.55,91.12 101.92,91.76 99.69,91.76 98.11,90.17 C13.+ | C13.+ | v86.36,90.17 C13.+
  Bottom 0.254: S1.16 S1.15 S1.14 S1.13 S1.12 S1.11 S1.10 S1.9
  Bottom 0.813: v86.36,17.14 v86.36,45.72 v86.36,74.3 v86.36,90.17 v86.36,102.87
GND  (via drill 0.6)
  Top 0.203: IC2.17 88.33,80.39 88.58,80.64 88.82,80.64 88.98,80.49 88.98,78.9 | 88.34,106.12 88.34,108.9 | 88.98,105.97 88.98,108.82 | 89.61,106.05 89.61,108.82 | 86.92,97.87 86.92,99.14 87,99.22 87,100.33 87.03,100.29 IC1.10 | 87,71.44 87,70.64 86.92,70.56 86.92,69.69 | 87,71.44 87,71.6 | 86.92,12.54 86.92,13.41 87,13.49 87,14.37 | 87,14.37 87,15.72 87.23,15.95 | 87,42.94 87,42.07 86.92,41.99 86.92,41.12 | 87,42.94 87,43.02 | 105.01,25.08 105.01,24.21 | 106.6,25.08 106.6,24.21 | 88.34,21.83 88.34,21.67 | 88.34,21.83 88.34,23.1 | 88.34,50.48 88.34,50.32 | 88.34,50.48 88.34,51.67 | 89.61,50.4 89.61,51.59 | IC2.10 87.03,71.47 87,71.44 | 88.34,50.48 88.27,50.48 88.33,50.41 IC3.17 | 89.61,50.4 89.63,50.38 IC3.15 | 89.61,50.4 89.61,50.32 | IC3.10 87.03,42.98 87,42.94 | IC4.10 87.03,14.4 87,14.37 | 88.34,21.83 88.42,21.83 88.33,21.74 IC4.17 | 105.01,25.08 105.01,25.09 IC5.5 | 105.01,25.08 IC5.5 | 106.6,25.08 106.61,25.09 IC5.3 | 106.6,25.08 IC5.3 | IC5.21 105.81,12.7 105.17,12.06 C8.2 | 105.81,16.59 105.81,17.86
  other vias: 105.41,22.23 107.31,32.38
  pour Top (isolate 0.508): -1.59,123.83 123.51,123.83 123.51,-0.95 -1.59,-0.95
  pour Bottom (isolate 0.508): -1.59,123.83 123.51,123.83 123.51,-0.95 -1.59,-0.95
N$1  (via drill 0.5)
  Top 0.254: RN2.5 78.02,115.66 77.79,115.89 v76.2,115.89
  Bottom 0.254: v76.2,115.89 75.56,115.89 68.9,109.22 SRV7.3
N$2
  Top 0.254: RN2.4 81.19,115.66 85.72,111.12 85.72,107.31 85.73,107.32 IC1.21
N$3  (via drill 0.5)
  Top 0.254: RN2.6 77.23,114.86 v77.15,114.94
  Bottom 0.254: v77.15,114.94 75.56,114.94 68.58,107.95 60.96,107.95 60.64,108.27 SRV6.3
N$4
  Top 0.254: RN2.3 81.04,114.86 85.09,110.81 85.09,107.31 85.08,107.32 IC1.22
N$5  (via drill 0.5)
  Top 0.203: 76.28,114.06 RN2.7
  Top 0.254: v76.2,113.98 76.28,114.06
  Bottom 0.254: v76.2,113.98 75.56,113.98 68.9,107.31 54.93,107.31 53.98,108.27 SRV5.3
N$6
  Top 0.254: IC1.23 84.43,110.51 80.89,114.06 RN2.2
N$7  (via drill 0.5)
  Top 0.254: RN2.8 78.02,113.26 77.79,113.03 v77.15,113.03
  Bottom 0.254: v77.15,113.03 75.56,113.03 69.22,106.68 48.9,106.68 47.31,108.27 SRV4.3
N$8
  Top 0.254: IC1.24 83.78,110.21 80.73,113.26 RN2.1
N$9  (via drill 0.5)
  Top 0.254: RN3.5 78.02,111.85 77.79,112.08 v76.2,112.08
  Bottom 0.254: v76.2,112.08 75.56,112.08 69.53,106.05 42.86,106.05 40.64,108.27 SRV3.3
N$10
  Top 0.254: IC1.25 83.13,109.91 81.19,111.85 RN3.4
N$11  (via drill 0.5)
  Top 0.254: RN3.6 77.23,111.05 v77.15,111.12
  Bottom 0.254: v77.15,111.12 75.56,111.12 69.85,105.41 36.83,105.41 33.97,108.27 SRV2.3
N$12
  Top 0.254: IC1.26 82.48,109.61 81.04,111.05 RN3.3
N$13  (via drill 0.5)
  Top 0.203: 76.28,110.25 RN3.7
  Top 0.254: v76.2,110.17 76.28,110.25
  Bottom 0.254: v76.2,110.17 75.56,110.17 70.17,104.78 30.8,104.78 27.3,108.27 SRV1.3
N$14
  Top 0.254: IC1.27 81.83,109.3 80.89,110.25 RN3.2
N$15  (via drill 0.5)
  Top 0.254: RN3.8 78.02,109.45 77.79,109.22 v77.15,109.22
  Bottom 0.254: v77.15,109.22 75.56,109.22 70.48,104.14 24.77,104.14 20.64,108.27 SRV0.3
N$16
  Top 0.254: IC1.28 81.18,109 80.73,109.45 RN3.1
N$17  (via drill 0.5)
  Top 0.254: RN4.5 78.02,98.2 77.79,98.42 v77.15,98.42
  Bottom 0.254: v77.15,98.42 75.56,98.42 70.48,103.5 24.77,103.5 20.64,99.38 SRV8.3
N$18
  Top 0.254: RN5.1 81.19,91.99 85.73,96.53 IC1.8
N$19  (via drill 0.5)
  Top 0.203: 76.28,97.4 RN4.6
  Top 0.254: v76.2,97.47 76.28,97.4
  Bottom 0.254: v76.2,97.47 75.56,97.47 70.17,102.87 30.8,102.87 27.3,99.38 SRV9.3
N$20
  Top 0.254: RN5.2 81.04,92.79 85.08,96.83 IC1.7
N$21  (via drill 0.5)
  Top 0.254: RN4.7 77.23,96.6 v77.15,96.52
  Bottom 0.254: v77.15,96.52 75.56,96.52 69.85,102.23 36.83,102.23 33.97,99.38 SRV10.3
N$22
  Top 0.254: RN5.3 80.89,93.59 84.43,97.13 IC1.6
N$23  (via drill 0.5)
  Top 0.254: RN4.8 78.02,95.8 77.79,95.57 v76.2,95.57
  Bottom 0.254: v76.2,95.57 75.56,95.57 69.53,101.6 42.86,101.6 40.64,99.38 SRV11.3
N$24
  Top 0.254: IC1.5 83.78,97.44 80.73,94.39 RN5.4
N$25  (via drill 0.5)
  Top 0.254: RN5.5 78.02,94.39 77.79,94.61 v77.15,94.61
  Bottom 0.254: v77.15,94.61 75.56,94.61 69.22,100.97 48.9,100.97 47.31,99.38 SRV12.3
N$26
  Top 0.254: IC1.4 83.13,97.74 81.19,95.8 RN4.1
N$27  (via drill 0.5)
  Top 0.203: 76.28,93.59 RN5.6
  Top 0.254: v76.2,93.66 76.28,93.59
  Bottom 0.254: v76.2,93.66 75.56,93.66 68.9,100.33 54.93,100.33 53.98,99.38 SRV13.3
N$28
  Top 0.254: IC1.3 82.48,98.04 81.04,96.6 RN4.2
N$29  (via drill 0.5)
  Top 0.254: RN5.7 77.23,92.79 v77.15,92.71
  Bottom 0.254: v77.15,92.71 75.56,92.71 68.58,99.69 60.96,99.69 60.64,99.38 SRV14.3
N$30
  Top 0.254: IC1.2 81.83,98.34 80.89,97.4 RN4.3
N$31  (via drill 0.5)
  Top 0.254: RN5.8 78.02,91.99 77.79,91.76 v76.2,91.76
  Bottom 0.254: v76.2,91.76 75.56,91.76 68.9,98.42 SRV15.3
N$32
  Top 0.254: IC1.1 81.18,98.64 80.73,98.2 RN4.4
N$33
  Top 0.254: IC3.21 85.73,53.97 81.19,58.51 RN6.4
N$34
  Top 0.254: IC3.22 85.08,53.66 81.04,57.71 RN6.3
N$35
  Top 0.813: 63.5,91.12 64.14,91.76 64.14,95.25 64.77,95.89 SRV15.2 | SRV14.2 58.42,95.89 57.78,95.25 57.78,91.12 | SRV13.2 51.75,95.89 51.12,95.25 51.12,91.12 | SRV12.2 45.09,95.89 44.45,95.25 44.45,91.12 | 17.78,91.12 17.78,95.25 18.41,95.89 SRV8.2 | 24.45,91.12 24.45,95.25 25.08,95.89 SRV9.2 | SRV10.2 31.43,95.89 30.8,95.25 30.8,91.12 | SRV11.2 38.42,95.89 37.78,95.25 37.78,91.12
  Top 1.778: 63.5,91.12 57.78,91.12 51.12,91.12 44.45,91.12 37.78,91.12 30.8,91.12 24.45,91.12 17.78,91.12 13.34,91.12 10.28,94.18 X1.3
N$36
  Top 0.254: IC3.23 84.43,53.36 80.89,56.91 RN6.2
N$37
  Top 0.254: IC3.24 83.78,53.06 80.73,56.11 RN6.1
N$38
  Top 0.254: IC3.25 83.13,52.76 81.19,54.7 RN7.4
N$39
  Top 0.254: IC3.26 82.48,52.45 81.04,53.9 RN7.3
N$40
  Top 0.254: IC3.27 81.83,52.15 80.89,53.1 RN7.2
N$41
  Top 0.254: IC3.28 81.18,51.85 80.73,52.3 RN7.1
N$42
  Top 0.813: 63.5,87.95 64.14,87.31 64.14,83.82 64.77,83.19 SRV23.2 | 17.78,87.95 17.78,83.82 18.41,83.19 SRV16.2 | 24.45,87.95 24.45,83.82 25.08,83.19 SRV17.2 | 31.11,87.95 31.11,83.82 31.75,83.19 SRV18.2 | 37.78,87.95 37.78,83.82 38.42,83.19 SRV19.2 | 44.45,87.95 44.45,83.82 45.09,83.19 SRV20.2 | 50.8,87.95 50.8,83.82 51.44,83.19 SRV21.2 | SRV22.2 58.42,83.19 57.78,83.82 57.78,87.95
  Top 1.778: 63.5,87.95 57.78,87.95 50.8,87.95 44.45,87.95 37.78,87.95 31.11,87.95 24.45,87.95 17.78,87.95 15.56,87.95 13.34,87.95 9.56,84.18 X1.5
N$43
  Top 0.254: IC3.1 81.18,41.49 80.73,41.05 RN8.4
N$44
  Top 0.254: IC3.2 81.83,41.19 80.89,40.25 RN8.3
N$45
  Top 0.254: IC3.3 82.48,40.89 81.04,39.45 RN8.2
N$46
  Top 0.254: IC3.4 83.13,40.59 81.19,38.65 RN8.1
N$47
  Top 0.254: IC3.5 83.78,40.28 80.73,37.24 RN9.4
N$48
  Top 0.254: IC3.6 84.43,39.98 80.89,36.44 RN9.3
N$49
  Top 0.254: IC3.7 85.08,39.68 81.04,35.64 RN9.2
N$50
  Top 0.254: IC3.8 85.73,39.38 81.19,34.84 RN9.1
N$51
  Top 0.254: IC2.21 85.73,82.54 81.19,87.08 RN10.4
N$52
  Top 0.254: IC2.22 85.08,82.24 81.04,86.28 RN10.3
N$53  (via drill 0.5)
  Top 0.254: RN10.5 78.02,87.08 77.79,87.31 v76.2,87.31
  Bottom 0.254: v76.2,87.31 75.56,87.31 68.9,80.64 SRV23.3
N$54
  Top 0.254: IC2.23 84.43,81.94 80.89,85.48 RN10.2
N$55  (via drill 0.5)
  Top 0.254: RN10.6 77.23,86.28 v77.15,86.36
  Bottom 0.254: v77.15,86.36 75.56,86.36 68.58,79.38 60.96,79.38 60.64,79.69 SRV22.3
N$56
  Top 0.254: IC2.24 83.78,81.64 80.73,84.68 RN10.1
N$57  (via drill 0.5)
  Top 0.203: 76.28,85.48 RN10.7
  Top 0.254: v76.2,85.41 76.28,85.48
  Bottom 0.254: v76.2,85.41 75.56,85.41 68.9,78.74 54.93,78.74 53.98,79.69 SRV21.3
N$58
  Top 0.254: IC2.25 83.13,81.33 81.19,83.27 RN11.4
N$59  (via drill 0.5)
  Top 0.254: RN10.8 78.02,84.68 77.79,84.45 v77.15,84.45
  Bottom 0.254: v77.15,84.45 75.56,84.45 69.22,78.11 48.9,78.11 47.31,79.69 SRV20.3
N$60
  Top 0.254: IC2.26 82.48,81.03 81.04,82.47 RN11.3
N$61  (via drill 0.5)
  Top 0.254: RN11.5 78.02,83.27 77.79,83.5 v76.2,83.5
  Bottom 0.254: v76.2,83.5 75.56,83.5 69.53,77.47 42.86,77.47 40.64,79.69 SRV19.3
N$62
  Top 0.254: IC2.27 81.83,80.73 80.89,81.67 RN11.2
N$63  (via drill 0.5)
  Top 0.254: RN11.6 77.23,82.47 v77.15,82.55
  Bottom 0.254: v77.15,82.55 75.56,82.55 69.85,76.83 36.83,76.83 33.97,79.69 SRV18.3
N$64
  Top 0.254: IC2.28 81.18,80.42 80.73,80.87 RN11.1
N$65  (via drill 0.5)
  Top 0.203: 76.28,81.67 RN11.7
  Top 0.254: v76.2,81.6 76.28,81.67
  Bottom 0.254: v76.2,81.6 75.56,81.6 70.17,76.2 30.8,76.2 27.3,79.69 SRV17.3
N$66
  Top 0.254: IC2.8 85.73,67.95 81.19,63.41 RN13.1
N$67  (via drill 0.5)
  Top 0.254: RN11.8 78.02,80.87 77.79,80.64 v77.15,80.64
  Bottom 0.254: v77.15,80.64 75.56,80.64 70.48,75.56 24.77,75.56 20.64,79.69 SRV16.3
N$68
  Top 0.254: IC2.7 85.08,68.25 81.04,64.21 RN13.2
N$69  (via drill 0.5)
  Top 0.254: RN12.5 78.02,69.62 77.79,69.85 v77.15,69.85
  Bottom 0.254: SRV24.3 20.64,70.8 24.77,74.93 70.48,74.93 75.56,69.85 v77.15,69.85
N$70
  Top 0.254: IC2.6 84.43,68.56 80.89,65.01 RN13.3
N$71  (via drill 0.5)
  Top 0.203: 76.28,68.82 RN12.6
  Top 0.254: v76.2,68.9 76.28,68.82
  Bottom 0.254: SRV25.3 27.3,70.8 30.8,74.3 70.17,74.3 75.56,68.9 v76.2,68.9
N$72
  Top 0.254: IC2.5 83.78,68.86 80.73,65.81 RN13.4
N$73  (via drill 0.5)
  Top 0.254: RN12.7 77.23,68.02 v77.15,67.94
  Bottom 0.254: v77.15,67.94 75.56,67.94 69.85,73.66 36.83,73.66 33.97,70.8 SRV26.3
N$74
  Top 0.254: IC2.4 83.13,69.16 81.19,67.22 RN12.1
N$75  (via drill 0.5)
  Top 0.254: RN12.8 78.02,67.22 77.79,66.99 v76.2,66.99
  Bottom 0.254: v76.2,66.99 75.56,66.99 69.53,73.03 42.86,73.03 40.64,70.8 SRV27.3
N$76
  Top 0.254: IC2.3 82.48,69.47 81.04,68.02 RN12.2
N$77  (via drill 0.5)
  Top 0.254: RN13.5 78.02,65.81 77.79,66.04 v77.15,66.04
  Bottom 0.254: v77.15,66.04 75.56,66.04 69.22,72.39 48.9,72.39 47.31,70.8 SRV28.3
N$78
  Top 0.254: IC2.2 81.83,69.77 80.89,68.82 RN12.3
N$79  (via drill 0.5)
  Top 0.203: 76.28,65.01 RN13.6
  Top 0.254: v76.2,65.09 76.28,65.01
  Bottom 0.254: v76.2,65.09 75.56,65.09 68.9,71.75 54.93,71.75 53.98,70.8 SRV29.3
N$80
  Top 0.254: IC2.1 81.18,70.07 80.73,69.62 RN12.4
N$81  (via drill 0.5)
  Top 0.254: RN13.7 77.23,64.21 v77.15,64.14
  Bottom 0.254: v77.15,64.14 75.56,64.14 68.58,71.12 60.96,71.12 60.64,70.8 SRV30.3
N$82
  Top 0.254: IC4.8 85.73,10.8 81.19,6.26 RN17.1
N$83  (via drill 0.5)
  Top 0.254: RN13.8 78.02,63.41 77.79,63.18 v76.2,63.18
  Bottom 0.254: v76.2,63.18 75.56,63.18 68.9,69.85 SRV31.3
N$84
  Top 0.254: IC4.7 85.08,11.11 81.04,7.06 RN17.2
N$85
  Top 0.813: 63.5,62.55 64.14,63.18 64.14,66.67 64.77,67.31 SRV31.2 | 17.78,62.55 17.78,66.67 18.41,67.31 SRV24.2 | 24.13,62.55 24.13,66.67 24.77,67.31 SRV25.2 | 31.11,62.55 31.11,66.67 31.75,67.31 SRV26.2 | 37.78,62.55 37.78,66.67 38.42,67.31 40.32,67.31 40.64,67.63 SRV27.2 | 44.45,62.55 44.45,66.67 45.09,67.31 SRV28.2 | 50.8,62.55 50.8,66.67 51.44,67.31 SRV29.2 | SRV30.2 58.42,67.31 57.78,66.67 57.78,62.55
  Top 1.778: 63.5,62.55 57.78,62.55 50.8,62.55 44.45,62.55 37.78,62.55 31.11,62.55 24.13,62.55 17.78,62.55 15.56,62.55 13.97,64.14 13.97,71.44 11.23,74.18 X1.7
N$86
  Top 0.254: IC4.6 84.43,11.41 80.89,7.86 RN17.3
N$87
  Top 0.254: IC5.7 103.41,32.92 104.46,33.97 105.41,33.97 | 105.41,33.97 XTAL1.2 | C6.1 107,35.56 105.41,33.97
N$88
  Top 0.254: IC5.8 102.61,32.96 101.6,33.97 100.65,33.97 | 100.65,33.97 XTAL1.1 | C5.1 99.06,35.56 100.65,33.97
N$89
  Top 0.254: IC4.5 83.78,11.71 80.73,8.66 RN17.4
N$90
  Top 0.254: IC4.4 83.13,12.01 81.19,10.07 RN16.1
N$91
  Top 0.254: IC4.3 82.48,12.31 81.04,10.87 RN16.2
N$92
  Top 0.254: IC4.2 81.83,12.62 80.89,11.67 RN16.3
N$93
  Top 0.254: IC4.1 81.18,12.92 80.73,12.47 RN16.4
N$94
  Top 0.254: IC4.28 81.18,23.27 80.73,23.72 RN15.1
N$95
  Top 0.254: IC4.27 81.83,23.58 80.89,24.52 RN15.2
N$96
  Top 0.254: IC4.26 82.48,23.88 81.04,25.32 RN15.3
N$97
  Top 0.254: IC4.25 83.13,24.18 81.19,26.12 RN15.4
N$98
  Top 0.254: IC4.24 83.78,24.48 80.73,27.53 RN14.1
N$99
  Top 0.254: IC4.23 84.43,24.79 80.89,28.33 RN14.2
N$100
  Top 0.254: IC4.22 85.08,25.09 81.04,29.13 RN14.3
N$101
  Top 0.254: IC4.21 85.73,25.39 81.19,29.93 RN14.4
N$102
  Bottom 0.813: X3.1 109.06,115.09 D1.A
N$104
  Top 0.813: D1.C 118.11,95.89 C11.+ 118.11,93.66 114.61,90.16 C14.+ 107.71,89.29 IC7.3
N$105  (via drill 0.5)
  Top 0.254: RN6.5 78.02,58.51 77.79,58.74 v76.2,58.74
  Bottom 0.254: v76.2,58.74 75.56,58.74 68.9,52.07 SRV39.3
N$107  (via drill 0.5)
  Top 0.254: RN6.6 77.23,57.71 v77.15,57.78
  Bottom 0.254: v77.15,57.78 75.56,57.78 68.58,50.8 60.96,50.8 60.64,51.12 SRV38.3
N$108
  Top 0.813: 63.5,59.37 64.14,58.74 64.14,55.24 64.77,54.61 SRV39.2 | 57.15,59.37 57.47,59.05 | SRV38.2 58.42,54.61 57.78,55.24 57.78,59.37 | SRV37.2 51.44,54.61 50.8,55.24 50.8,58.74 50.48,59.05 50.48,59.37 | SRV36.2 44.77,54.61 44.13,55.24 44.13,59.37 | SRV34.2 31.43,54.61 30.8,55.24 30.8,59.37 | SRV33.2 25.08,54.61 24.45,55.24 24.45,59.37 | SRV32.2 18.1,54.61 17.46,55.24 17.46,59.37 | SRV35.2 38.1,54.61 37.47,55.24 37.47,59.37 37.47,59.69
  Top 1.778: 57.15,59.37 50.48,59.37 44.13,59.37 37.47,59.37 30.8,59.37 24.45,59.37 17.46,59.37 15.56,59.37 9.56,53.38 X2.1 | 57.78,59.37 63.5,59.37
  Top 1.93: 57.15,59.37 57.78,59.37
N$109  (via drill 0.5)
  Top 0.203: 76.28,56.91 RN6.7
  Top 0.254: v76.2,56.83 76.28,56.91
  Bottom 0.254: v76.2,56.83 75.56,56.83 68.9,50.16 54.93,50.16 53.98,51.12 SRV37.3
N$111  (via drill 0.5)
  Top 0.254: RN6.8 78.02,56.11 77.79,55.88 v77.15,55.88
  Bottom 0.254: v77.15,55.88 75.56,55.88 69.22,49.53 48.58,49.53 47.31,50.8 SRV36.3
N$113  (via drill 0.5)
  Top 0.254: RN7.5 78.02,54.7 77.79,54.93 v76.2,54.93
  Bottom 0.254: v76.2,54.93 75.56,54.93 69.53,48.9 42.86,48.9 40.64,51.12 SRV35.3
N$115  (via drill 0.5)
  Top 0.254: RN7.6 77.23,53.9 v77.15,53.98
  Bottom 0.254: v77.15,53.98 75.56,53.98 69.85,48.26 36.83,48.26 33.97,51.12 SRV34.3
N$117  (via drill 0.5)
  Top 0.203: 76.28,53.1 RN7.7
  Top 0.254: v76.2,53.02 76.28,53.1
  Bottom 0.254: v76.2,53.02 75.56,53.02 70.17,47.62 30.8,47.62 27.3,51.12 SRV33.3
N$119  (via drill 0.5)
  Top 0.254: RN7.8 78.02,52.3 77.79,52.07 v77.15,52.07
  Bottom 0.254: v77.15,52.07 75.56,52.07 70.48,46.99 24.77,46.99 20.64,51.12 SRV32.3
N$121  (via drill 0.5)
  Top 0.254: RN8.5 78.02,41.05 77.79,41.27 v77.15,41.27
  Bottom 0.254: v77.15,41.27 75.56,41.27 70.48,46.35 24.77,46.35 20.64,42.23 SRV40.3
N$123  (via drill 0.5)
  Top 0.203: 76.28,40.25 RN8.6
  Top 0.254: v76.2,40.32 76.28,40.25
  Bottom 0.254: v76.2,40.32 75.56,40.32 70.17,45.72 30.8,45.72 27.3,42.23 SRV41.3
N$125  (via drill 0.5)
  Top 0.254: RN8.7 77.23,39.45 v77.15,39.37
  Bottom 0.254: v77.15,39.37 75.56,39.37 69.85,45.09 36.51,45.09 33.97,42.55 SRV42.3
N$127  (via drill 0.5)
  Top 0.254: RN8.8 78.02,38.65 77.79,38.42 v76.2,38.42
  Bottom 0.254: v76.2,38.42 75.56,38.42 69.53,44.45 42.86,44.45 40.64,42.23 SRV43.3
N$129  (via drill 0.5)
  Top 0.254: RN9.5 78.02,37.24 77.79,37.47 v77.15,37.47
  Bottom 0.254: v77.15,37.47 75.56,37.47 69.22,43.81 48.9,43.81 47.31,42.23 SRV44.3
N$131  (via drill 0.5)
  Top 0.203: 76.28,36.44 RN9.6
  Top 0.254: v76.2,36.51 76.28,36.44
  Bottom 0.254: v76.2,36.51 75.56,36.51 68.9,43.18 54.93,43.18 53.98,42.23 SRV45.3
N$133  (via drill 0.5)
  Top 0.254: RN9.7 77.23,35.64 v77.15,35.56
  Bottom 0.254: v77.15,35.56 75.56,35.56 68.58,42.55 60.96,42.55 60.64,42.23 SRV46.3
N$135  (via drill 0.5)
  Top 0.254: RN9.8 78.02,34.84 77.79,34.61 v76.2,34.61
  Bottom 0.254: v76.2,34.61 75.56,34.61 68.9,41.27 SRV47.3
N$137
  Top 0.813: 63.5,33.97 64.14,34.61 64.14,38.1 64.77,38.73 SRV47.2 | SRV46.2 58.1,38.73 57.47,38.1 57.47,33.97 | SRV45.2 51.75,38.73 51.12,38.1 51.12,33.97 | SRV44.2 44.77,38.73 44.13,38.1 44.13,33.97 | SRV43.2 38.1,38.73 37.47,38.1 37.47,33.97 | SRV42.2 31.43,38.73 30.8,38.1 30.8,33.97 | SRV41.2 24.77,38.73 24.13,38.1 24.13,33.97 | SRV40.2 18.1,38.73 17.46,38.1 17.46,33.97
  Top 1.778: 63.5,33.97 57.47,33.97 51.12,33.97 44.13,33.97 37.47,33.97 30.8,33.97 24.13,33.97 17.46,33.97 15.88,33.97 14.29,35.56 14.29,39.37 12.7,40.96 10.28,43.38 X2.3
  Top 1.93: 12.7,40.96 12.38,41.27
N$138
  Top 0.254: RN1.2 S1.1 104.78,63.18 106.05,61.91 111.12,61.91 115.25,57.78 115.25,29.53 116.2,28.57 116.2,19.37 112.08,15.24 107.95,15.24 107.41,15.78 IC5.23
N$139
  Top 0.254: RN1.3 S1.2 104.78,60.64 106.05,59.37 111.12,59.37 114.62,55.88 114.62,29.21 115.57,28.26 115.57,19.68 112.55,16.66 IC5.24
N$140
  Top 0.254: RN1.4 S1.3 104.78,58.1 106.05,56.83 111.12,56.83 113.98,53.98 113.98,28.89 114.94,27.94 114.94,20 113.09,18.16 IC5.25
N$157  (via drill 0.5)
  Top 0.254: RN14.5 78.02,29.93 77.79,30.16 v76.2,30.16
  Bottom 0.254: v76.2,30.16 75.56,30.16 68.9,23.5 SRV55.3
N$159  (via drill 0.5)
  Top 0.254: RN14.6 77.23,29.13 v77.15,29.21
  Bottom 0.254: v77.15,29.21 75.56,29.21 68.58,22.23 60.96,22.23 60.64,22.54 SRV54.3
N$161  (via drill 0.5)
  Top 0.203: 76.28,28.33 RN14.7
  Top 0.254: v76.2,28.26 76.28,28.33
  Bottom 0.254: v76.2,28.26 75.56,28.26 68.9,21.59 54.93,21.59 53.98,22.54 SRV53.3
N$163  (via drill 0.5)
  Top 0.254: RN14.8 78.02,27.53 77.79,27.3 v77.15,27.3
  Bottom 0.254: v77.15,27.3 75.56,27.3 69.22,20.95 48.9,20.95 47.31,22.54 SRV52.3
N$165  (via drill 0.5)
  Top 0.254: RN15.5 78.02,26.12 77.79,26.35 v76.2,26.35
  Bottom 0.254: v76.2,26.35 75.56,26.35 69.53,20.32 42.86,20.32 40.64,22.54 SRV51.3
N$167  (via drill 0.5)
  Top 0.254: RN15.6 77.23,25.32 v77.15,25.4
  Bottom 0.254: v77.15,25.4 75.56,25.4 69.85,19.68 36.83,19.68 33.97,22.54 SRV50.3
N$169  (via drill 0.5)
  Top 0.203: 76.28,24.52 RN15.7
  Top 0.254: v76.2,24.45 76.28,24.52
  Bottom 0.254: v76.2,24.45 75.56,24.45 70.17,19.05 30.8,19.05 27.3,22.54 SRV49.3
N$171  (via drill 0.5)
  Top 0.254: RN15.8 78.02,23.72 77.79,23.5 v77.15,23.5
  Bottom 0.254: v77.15,23.5 75.56,23.5 70.48,18.41 24.77,18.41 20.64,22.54 SRV48.3
N$172
  Top 0.813: 63.5,30.8 64.14,30.16 64.14,26.67 64.77,26.04 SRV55.2 | 24.13,30.8 24.13,26.67 24.77,26.04 SRV49.2 | 17.78,30.8 17.78,26.67 18.41,26.04 SRV48.2 | 31.11,30.8 31.11,26.67 31.75,26.04 SRV50.2 | 37.78,30.8 37.78,26.67 38.42,26.04 SRV51.2 | 44.45,30.8 44.45,26.67 45.09,26.04 SRV52.2 | 50.8,30.8 50.8,26.67 51.44,26.04 SRV53.2 | SRV54.2 58.1,26.04 57.47,26.67 57.47,30.8
  Top 1.778: 63.5,30.8 57.47,30.8 50.8,30.8 44.45,30.8 37.78,30.8 31.11,30.8 24.13,30.8 17.78,30.8 13.34,30.8 10.76,33.38 X2.5
N$173  (via drill 0.5)
  Top 0.254: RN16.5 78.02,12.47 77.79,12.7 v77.15,12.7
  Bottom 0.254: v77.15,12.7 75.56,12.7 70.48,17.78 24.77,17.78 20.64,13.65 SRV56.3
N$175  (via drill 0.5)
  Top 0.203: 76.28,11.67 RN16.6
  Top 0.254: v76.2,11.75 76.28,11.67
  Bottom 0.254: SRV57.3 27.3,13.65 30.8,17.14 70.17,17.14 75.56,11.75 v76.2,11.75
N$176
  Top 0.813: 63.5,5.4 64.14,6.03 64.14,9.53 64.77,10.16 SRV63.2 | 17.46,5.4 17.46,9.53 18.1,10.16 SRV56.2 | 24.13,5.4 24.13,9.53 24.77,10.16 SRV57.2 | 30.8,5.4 30.8,9.53 31.43,10.16 SRV58.2 | SRV59.2 38.42,10.16 37.78,9.53 37.78,5.4 | 44.45,5.4 44.45,9.53 45.09,10.16 SRV60.2 | SRV61.2 51.44,10.16 50.8,9.53 50.8,5.4 | SRV62.2 58.1,10.16 57.47,9.53 57.47,5.4
  Top 1.778: 63.5,5.4 57.47,5.4 50.8,5.4 44.45,5.4 37.78,5.4 30.8,5.4 24.13,5.4 17.46,5.4 15.24,5.4 13.65,6.99 13.65,20.64 10.91,23.38 X2.7
N$177  (via drill 0.5)
  Top 0.254: RN16.7 77.23,10.87 v77.15,10.79
  Bottom 0.254: v77.15,10.79 75.56,10.79 69.85,16.51 36.83,16.51 33.97,13.65 SRV58.3
N$179  (via drill 0.5)
  Top 0.254: RN16.8 78.02,10.07 77.79,9.84 v76.2,9.84
  Bottom 0.254: v76.2,9.84 75.56,9.84 69.53,15.88 42.86,15.88 40.64,13.65 SRV59.3
N$181  (via drill 0.5)
  Top 0.254: RN17.5 78.02,8.66 77.79,8.89 v77.15,8.89
  Bottom 0.254: v77.15,8.89 75.56,8.89 69.22,15.24 48.9,15.24 47.31,13.65 SRV60.3
N$183  (via drill 0.5)
  Top 0.203: 76.28,7.86 RN17.6
  Top 0.254: v76.2,7.94 76.28,7.86
  Bottom 0.254: v76.2,7.94 75.56,7.94 68.9,14.61 54.93,14.61 53.98,13.65 SRV61.3
N$185  (via drill 0.5)
  Top 0.254: RN17.7 77.23,7.06 v77.15,6.99
  Bottom 0.254: v77.15,6.99 75.56,6.99 68.58,13.97 60.96,13.97 60.64,13.65 SRV62.3
N$187  (via drill 0.5)
  Top 0.254: RN17.8 78.02,6.26 77.79,6.03 v76.2,6.03
  Bottom 0.254: v76.2,6.03 75.56,6.03 68.9,12.7 SRV63.3
N$190
  Top 0.254: RN1.5 S1.4 104.78,55.56 106.05,54.29 111.12,54.29 113.35,52.07 113.35,28.57 114.3,27.62 114.3,20.32 112.94,18.95 IC5.26
N$191
  Top 0.254: RN1.6 S1.5 104.78,53.02 106.05,51.75 111.12,51.75 112.71,50.16 112.71,28.26 113.67,27.3 113.67,20.64 112.78,19.75 IC5.27
N$192
  Top 0.254: RN1.7 S1.6 104.78,50.48 106.05,49.21 111.12,49.21 112.08,48.26 112.08,27.94 113.03,26.99 113.03,20.95 112.63,20.55 IC5.28
N$209
  Top 0.254: RN1.8 S1.7 104.78,47.94 106.05,46.67 111.12,46.67 111.44,46.35 111.44,27.94 109.86,26.35 108.27,26.35 108.21,26.3 IC5.1
N$210
  Top 0.254: RN1.9 S1.8 104.78,45.4 108.9,41.27 108.9,27.3 108.58,26.99 107.95,26.99 107.41,26.45 IC5.2
N$226  (via drill 0.5)
  Top 0.254: IC5.30 111.19,22.16 v111.76,21.59 | 105.41,101.92 IC6.1 v112.08,101.92
  Bottom 0.254: v111.76,21.59 113.03,21.59 113.67,22.23 113.67,100.33 v112.08,101.92
N$227  (via drill 0.5)
  Top 0.254: v109.86,105.73 IC6.4 | IC5.31 111.54,22.95 v111.76,23.18
  Bottom 0.254: v111.76,23.18 112.71,23.18 113.03,23.5 113.03,99.38 110.49,101.92 110.49,105.09 v109.86,105.73
N$228  (via drill 0.5)
  Top 0.254: IC6.2 106.68,103.19 v107.31,103.82 | v107.31,103.82 R2.2 | IC6.3 106.68,104.46 v107.31,103.82 | IC5.32 110.75,23.75 v111.76,24.77
  Bottom 0.254: v111.76,24.77 112.08,24.77 112.39,25.08 112.39,98.74 v107.31,103.82
N$231  (via drill 0.5)
  Top 0.254: JP1.5 99.69,11.11 100.65,12.06 R1.1 | IC5.29 107.72,21.36 v107.31,20.95
  Bottom 0.254: v107.31,20.95 99.69,13.34 JP1.5
RS285_A
  Top 0.254: IC6.6 97.16,104.46 89.06,112.55 X3.5
RS485_B
  Top 0.254: IC6.7 100.97,103.19 101.28,103.5 101.28,106.68 99.06,108.9 X3.3
SERVO_CS  (via drill 0.5)
  Top 0.254: IC4.11 87.68,12.33 90.17,9.84 v94.3,9.84 | v94.3,95.57 90.17,95.57 87.68,98.06 IC1.11 | IC3.11 87.68,40.91 90.17,38.42 v94.3,38.42 | IC2.11 87.68,69.48 90.17,66.99 v94.3,66.99 | IC5.14 94.55,19.75 v94.3,20
  Bottom 0.254: v94.3,9.84 v94.3,20 v94.3,38.42 v94.3,66.99 v94.3,95.57
SERVO_MISO  (via drill 0.5)
  Top 0.254: IC4.14 89.63,13.24 90.17,12.7 v91.44,12.7 | IC1.14 89.63,98.96 90.17,98.42 v91.44,98.42 | IC2.14 89.63,70.39 90.17,69.85 v91.44,69.85 | IC3.14 89.63,41.81 90.17,41.27 v91.44,41.27 | IC5.16 92.77,18.16 92.39,17.78 v91.44,17.78
  Bottom 0.254: v91.44,98.42 v91.44,69.85 v91.44,41.27 v91.44,17.78 v91.44,12.7 91.44,7.3 92.39,6.35 JP1.9
SERVO_MOSI  (via drill 0.5)
  Top 0.254: IC4.13 88.98,12.94 90.17,11.75 v92.39,11.75 | IC1.13 88.98,98.66 90.17,97.47 v92.39,97.47 | IC2.13 88.98,70.08 90.17,68.9 v92.39,68.9 | IC3.13 88.98,41.51 90.17,40.32 v92.39,40.32 | IC5.15 92.49,18.95 v92.39,19.05
  Bottom 0.254: v92.39,97.47 v92.39,68.9 v92.39,40.32 v92.39,19.05 v92.39,11.75 92.39,8.26 93.03,7.62 95.57,7.62 95.89,7.3 95.89,5.71 96.52,5.08 103.5,5.08 JP1.1
SERVO_SCLK  (via drill 0.5)
  Top 0.254: IC4.12 88.33,12.63 90.17,10.79 v93.34,10.79 | v93.34,96.52 90.17,96.52 88.33,98.36 IC1.12 | IC2.12 88.33,69.78 90.17,67.94 v93.34,67.94 | IC3.12 88.33,41.21 90.17,39.37 v93.34,39.37 | IC5.17 93.51,16.66 v93.34,16.83
  Bottom 0.254: v93.34,96.52 v93.34,67.94 v93.34,39.37 v93.34,16.83 v93.34,10.79 93.34,8.89 93.98,8.26 96.52,8.26 97.16,7.62 JP1.7
SRV0
  Top 0.813: 63.5,116.84 64.14,116.2 64.14,112.39 64.77,111.76 SRV7.2 | SRV0.2 18.41,111.76 17.78,112.39 17.78,116.84 | 24.13,116.84 24.13,112.39 24.77,111.76 SRV1.2 | 31.11,116.84 31.11,112.39 31.75,111.76 SRV2.2 | 37.15,116.84 37.15,112.39 37.78,111.76 SRV3.2 | 44.13,116.84 44.13,112.39 44.77,111.76 SRV4.2 | 51.12,116.84 51.12,112.39 51.75,111.76 SRV5.2 | SRV6.2 58.1,111.76 57.47,112.39 57.47,116.84
  Top 1.778: 63.5,116.84 57.47,116.84 51.12,116.84 44.13,116.84 37.15,116.84 31.11,116.84 24.13,116.84 17.78,116.84 15.88,116.84 14.29,115.25 14.29,107.31 11.59,104.62 | X1.1 11.15,104.18
  Top 1.93: 11.43,104.46 11.59,104.62 11.15,104.18

### Text on the board
tPlace: ServoMatrix
tNames: DPWR: 7-12V DC | G | G | G | G | G | G | G | G | A | G | B | - | + | + | + | + | + | + | + | + | + | S | S | S | S | S | S | S | S | RS485 | DPWR | + | SPWR | WHITE WIRES THIS SIDE | - | S | S | S | S | S | S | S | S | + | SPWR | + | + | + | + | + | + | + | + | G | G | G | G | G | G | G | G | - | + | SPWR | G | G | G | G | G | G | G | G | + | + | + | + | + | + | + | + | http://www.mondomatrix.com/ | - | S | S | S | S | S | S | S | S | Version 1.2 | + | SPWR | WHITE WIRES THIS SIDE | - | S | S | S | S | S | S | S | S | + | + | + | + | + | + | + | + | G | G | G | G | G | G | G | G | 0 | 1 | G | G | G | G | G | G | G | G | 2 | 3 | + | SPWR | + | + | + | + | + | + | + | + | 4 | S | S | S | S | S | S | S | S | 5 | - | ADDRESS | 6 | WHITE WIRES THIS SIDE | 7 | + | SPWR | S | S | S | S | S | S | S | S | - | + | + | + | + | + | + | + | + | G | G | G | G | G | G | G | G | + | SPWR | - | G | G | G | G | G | G | G | G | + | + | + | + | + | + | + | + | + | SPWR | S | S | S | S | S | S | S | S | - | WHITE WIRES THIS SIDE | S | S | S | S | S | S | S | S | + | + | + | + | + | + | + | + | G | G | G | G | G | G | G | G